# EAGLE design fuentesimetricafinal (EAGLE 7.6.0)
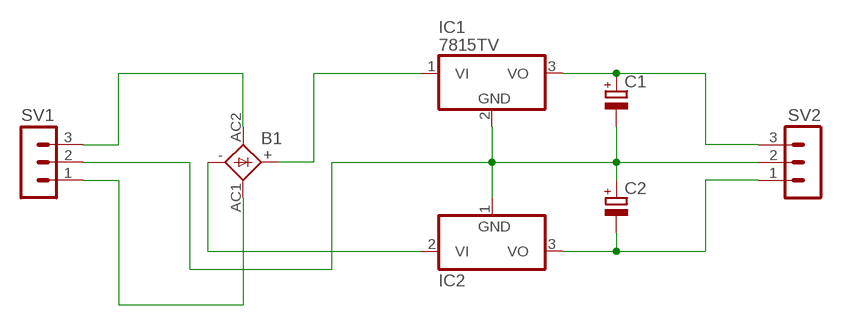
[diagram p0: schematic, sheet 1]

## Parts
B1  FBU4  [FBU4]
C1  CPOL-EUE3.5-8  [E3,5-8]
C2  CPOL-EUE3.5-8  [E3,5-8]
IC1  7815TV  [TO220V]
IC2  7915T  [TO220H]
SV1  MA03-1  [MA03-1]
SV2  MA03-1  [MA03-1]

## Nets
GND: C1.- C2.+ IC1.2(GND) IC2.1(GND) SV1.2 SV2.2
N$1: B1.AC2(AC1) SV1.3
N$2: B1.AC1(AC2) SV1.1
N$3: B1.- IC2.2(VI)
N$4: B1.+ IC1.1(VI)
N$8: C1.+ IC1.3(VO) SV2.3
N$9: C2.- IC2.3(VO) SV2.1

## Library data of the parts
B1 = rectifier:FBU4: FAGOR RECTIFIER grid 3 x 5 mm
C1 C2 = rcl:CPOL-EU: POLARIZED CAPACITOR, European symbol
IC1 = linear:78*: Positive VOLTAGE REGULATOR Source: http://cache.national.com/ds/LM/LM78L05.pdf http://www.fairchildsemi.com/ds/LM/LM7805.pdf
IC2 = linear:79*: Negative VOLTAGE REGULATOR
SV1 SV2 = con-lstb:MA03-1: PIN HEADER; OC_FARNELL: unknown; OC_NEWARK: unknown

## Board
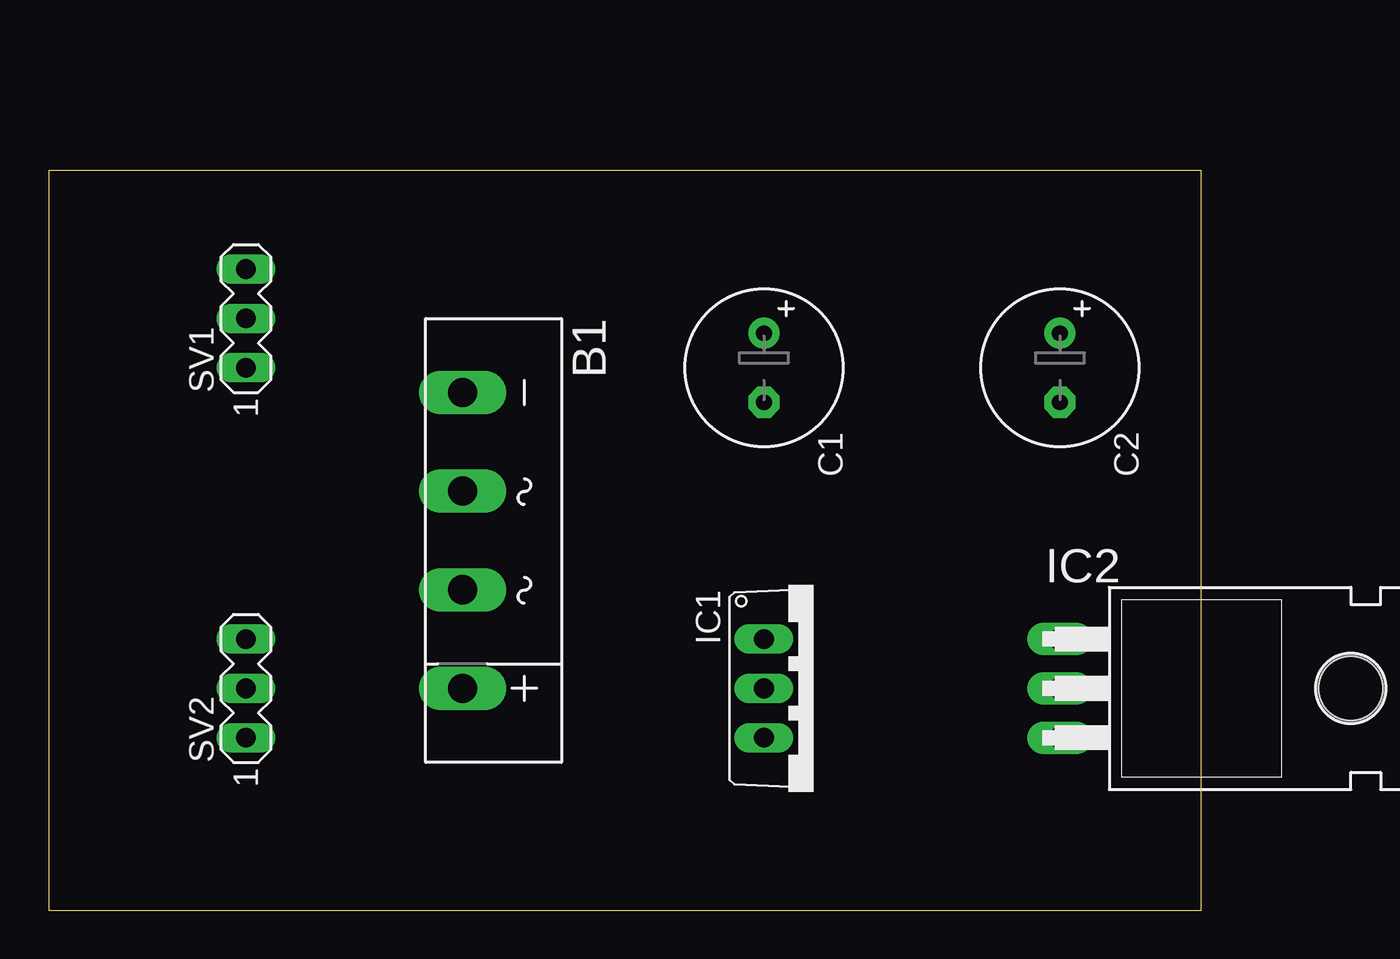
[diagram p1: board, top side]
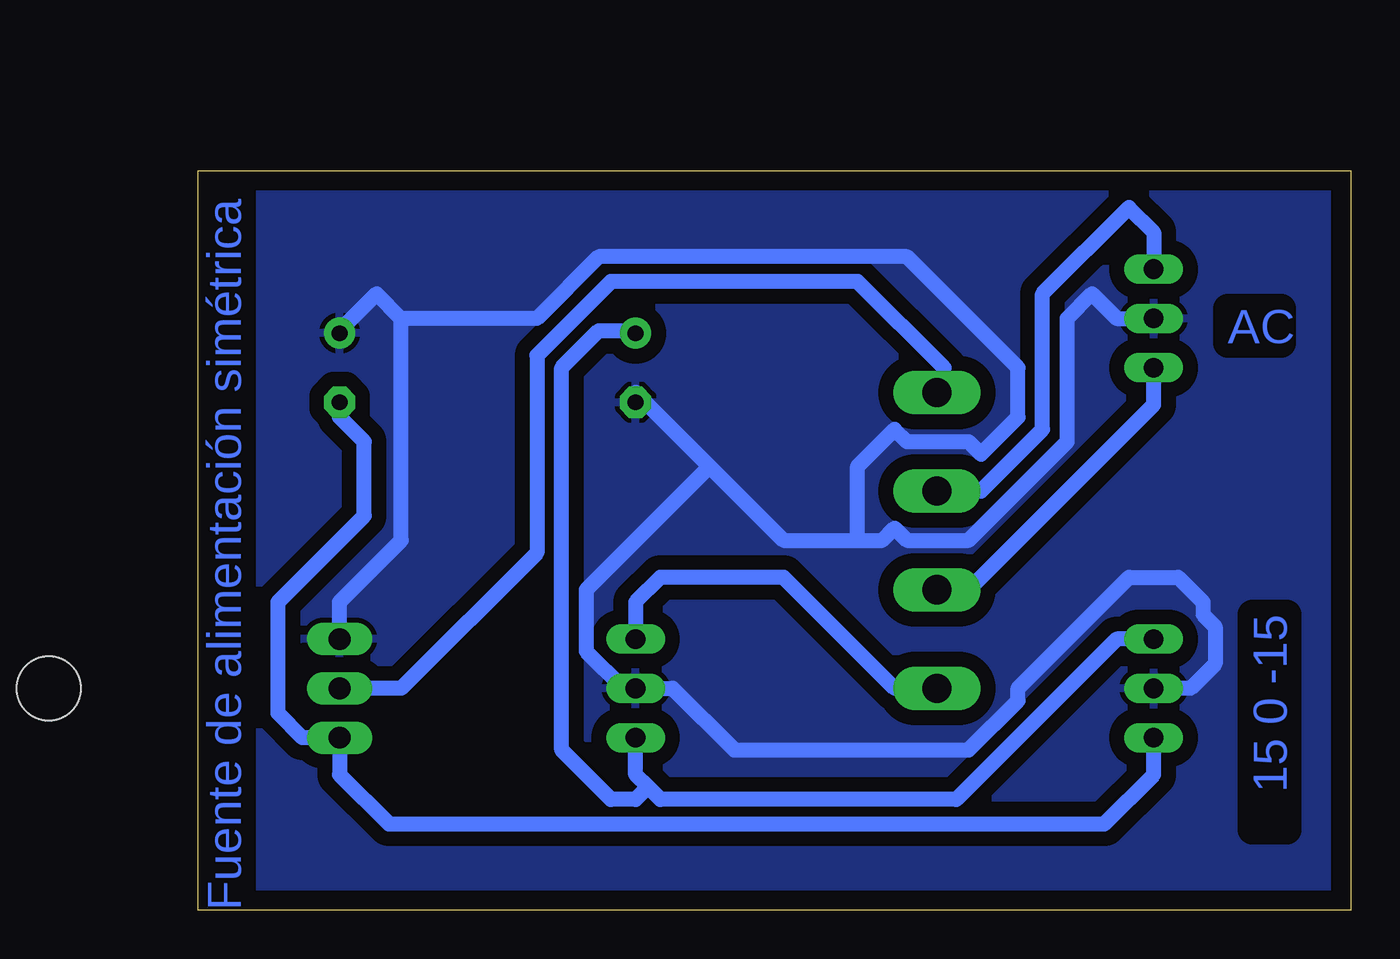
[diagram p2: board, bottom side, seen from below]

Size 59.36 x 38.09 mm. Coordinates in mm from the lower left corner, seen from the top.
Outline: 0,0 59.36,0 59.36,38.09 0,38.09 0,0
Copper layers (1*16): Top 0.035mm / dielectric 1.5mm / Bottom 0.035mm
Design rules "default *": minimum track width 30mil, minimum drill 24mil, track to track 30mil, track to pad 30mil, pad to pad 30mil, via to via 30mil, smd to smd 8mil, copper to edge 40mil, drill to drill 40mil, minimum pad ring 10mil, minimum via ring 8mil, stop-mask expansion 4mil, vias tented up to drill 0mil, thermal gap 10mil

### Footprints (pad centres in the part's own frame; a part is rotated, then mirrored left to right if it is on the bottom)
FBU4 = drill 1.499 long: + 7.62,-1.54; - -7.62,-1.54; AC1 2.54,-1.54; AC2 -2.54,-1.54
E3,5-8 = drill 0.813 pad 1.6: + -1.778,0 | drill 0.813 pad 1.6 octagon: - 1.778,0
TO220V = drill 1.016 long: 1 -2.54,-2.54; 2 0,-2.54; 3 2.54,-2.54
TO220H = drill 1.118 long: 1 -2.54,-10.16; 2 0,-10.16; 3 2.54,-10.16 | hole 3.302: 0,4.826
MA03-1 = drill 1.016 long: 1 -2.54,0; 2 0,0; 3 2.54,0

### Placement (x,y rotation side)
B1  22.86,19.05 270 top
C1  36.83,27.94 270 top
C2  52.07,27.94 270 top
IC1  39.37,11.43 270 top
IC2  62.23,11.43 270 top
SV1  10.16,30.48 90 top
SV2  10.16,11.43 90 top

### Tracks (layer width: path | path; a pad name or v marks a point on that pad's centre or on a via)
GND
  Bottom 0.762: SV2.2 8.26,11.43 6.98,12.7 6.98,14.6 7.62,15.24 7.62,15.88 8.89,17.14 11.43,17.14 17.14,11.43 17.14,10.8 19.68,8.26 31.75,8.26 34.93,11.43 IC1.2 37.47,11.43 39.37,13.34 39.37,16.51 33.02,22.86 | 48.9,30.48 50.17,31.75 52.07,29.84 C2.+ | 48.9,30.48 48.9,19.05 52.07,15.88 IC2.1 | SV1.2 12.06,30.48 13.33,31.75 14.61,30.48 14.61,24.13 19.68,19.05 22.86,19.05 23.5,19.69 24.13,19.05 25.4,19.05 | 25.4,19.05 29.21,19.05 33.02,22.86 | 33.02,22.86 36.83,26.67 C1.- | 48.9,30.48 41.91,30.48 38.74,33.66 22.86,33.66 17.14,27.94 17.14,25.4 19.05,23.5 19.68,24.13 22.86,24.13 23.5,24.77 25.4,22.86 25.4,19.05
  pour Bottom: 0,38.1 59.69,38.1 59.69,0 0,0
N$1
  Bottom 0.762: SV1.3 10.16,34.92 11.43,36.19 15.88,31.75 15.88,24.77 19.05,21.59 B1.AC2
N$2
  Bottom 0.762: SV1.1 10.16,26.03 19.68,16.51 B1.AC1
N$3
  Bottom 0.762: IC2.2 48.9,11.43 41.91,18.41 41.91,28.58 38.1,32.39 25.4,32.39 20.95,27.94 20.95,26.67 B1.-
N$4
  Bottom 0.762: IC1.1 36.83,15.88 35.56,17.14 29.21,17.14 23.5,11.43 B1.+
N$8
  Bottom 0.762: IC1.3 36.83,6.98 36.2,6.35 | 36.2,6.35 35.56,5.71 20.32,5.71 12.06,13.97 SV2.3 | 36.2,6.35 36.83,5.71 38.1,5.71 40.64,8.26 40.64,27.94 38.74,29.84 36.83,29.84 C1.+
N$9
  Bottom 0.762: SV2.1 10.16,6.98 12.7,4.45 49.53,4.45 52.07,6.98 IC2.3 53.98,8.89 55.25,10.16 55.25,15.88 50.8,20.32 50.8,24.13 52.07,25.4 C2.-

### Text on the board
Bottom: AC | 15 0 -15 | Fuente de alimentación simétrica